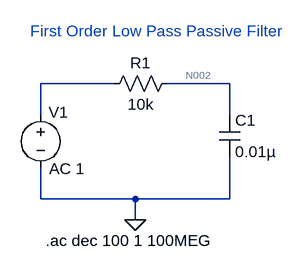
[diagram p0: schematic First Order Low pass Passive Filter.asc]
First Order Low pass Passive Filter.asc, the LTspice schematic file:
Version 4
SHEET 1 880 680
WIRE 160 -48 48 -48
WIRE 336 -48 240 -48
WIRE 48 0 48 -48
WIRE 336 0 336 -48
WIRE 48 128 48 80
WIRE 192 128 48 128
WIRE 336 128 336 64
WIRE 336 128 192 128
WIRE 192 160 192 128
FLAG 192 160 0
SYMBOL res 256 -64 R90
WINDOW 0 0 56 VBottom 2
WINDOW 3 32 56 VTop 2
SYMATTR InstName R1
SYMATTR Value 10k
SYMBOL cap 320 0 R0
SYMATTR InstName C1
SYMATTR Value 0.01µ
SYMBOL voltage 48 -16 R0
WINDOW 0 12 12 Left 2
WINDOW 123 13 98 Left 2
WINDOW 39 0 0 Left 0
SYMATTR InstName V1
SYMATTR Value ""
SYMATTR Value2 AC 1
TEXT 32 -128 Left 2 ;First Order Low Pass Passive Filter
TEXT 56 192 Left 2 !.ac dec 100 1 100MEG

The netlist it stands for:
* First Order Low pass Passive Filter.asc
R1 N002 N001 10k
C1 N002 0 0.01µ
V1 N001 0 AC 1
* First Order Low Pass Passive Filter
.ac dec 100 1 100MEG
.backanno
.end

* Results of the author's LTspice run, read from the files saved beside the schematic
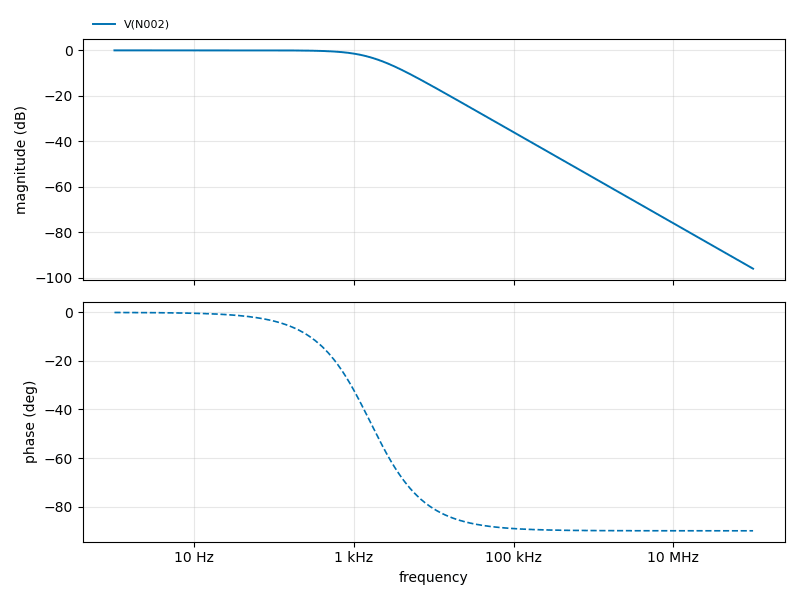
[diagram p1: AC Analysis of First Order Low pass Passive Filter.asc, plotted from the saved traces]
* AC Analysis, 1 run:
*   V(N002): -0.00 dB at 1 Hz, -95.96 dB at 100 MHz, peak -0.00 dB at 1 Hz, 3 dB below the peak at 1.591 kHz